# Altium schematic sheet POWER.SchDoc: POWER
size A4
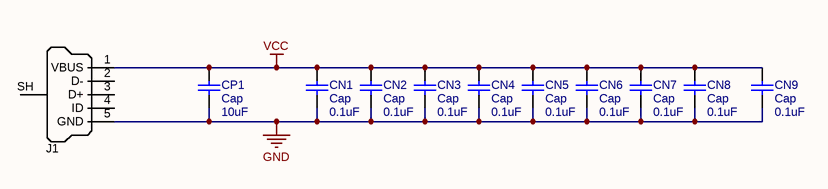
[diagram p0: POWER.SchDoc]

## Parts
CN1  Cap  value 0.1uF  [CAPR10.16-11.5x3.6]
CN2  Cap  value 0.1uF  [CAPR10.16-11.5x3.6]
CN3  Cap  value 0.1uF  [CAPR10.16-11.5x3.6]
CN4  Cap  value 0.1uF  [CAPR10.16-11.5x3.6]
CN5  Cap  value 0.1uF  [CAPR10.16-11.5x3.6]
CN6  Cap  value 0.1uF  [CAPR10.16-11.5x3.6]
CN7  Cap  value 0.1uF  [CAPR10.16-11.5x3.6]
CN8  Cap  value 0.1uF  [CAPR10.16-11.5x3.6]
CN9  Cap  value 0.1uF  [CAPR10.16-11.5x3.6]
CP1  Cap  value 10uF  [CAPE3.5mm]
J1  USB Micro Type B (recommended if hand soldering)  [USB Micro B SMD]  (value not drawn)

## Nets
GND: CN1.1 CN2.1 CN3.1 CN4.1 CN5.1 CN6.1 CN7.1 CN8.1 CN9.1 CP1.2 J1.5(GND)
VCC: CN1.2 CN2.2 CN3.2 CN4.2 CN5.2 CN6.2 CN7.2 CN8.2 CN9.2 CP1.1 J1.1(VBUS)

Not connected (* = marked no-connect by the designer): J1 2(D-) 3(D+) 4(ID) SH(Shell)

## Notes on the sheet
- Text
- Page
- PONG

## Library data of the parts
CN1-CN9 CP1 = Cap: Capacitor; Published: 8-Jun-2000; LatestRevisionDate: 17-Jul-2002; LatestRevisionNote: Re-released for DXP Platform.; PackageReference: RAD-0.3; Publisher: Altium Limited; PackageDescription: Radial Cap, Thru-Hole; 2 Leads; 0.3 in Pin Spacing
J1 = USB_Micro_TypeB_FCI: Connector SMD-THD USB Micro Type B middle mount; Manufacturer 1: FCI; Manufacturer Part Number 1: 10103593-0001LF; SCDType: undef; Package / Case: SMD/THD mid-mount; Supplier 1: Digi-Key; Supplier Part Number 1: 609-4049-1-ND